# EAGLE design Hive Server - Electron (EAGLE 8.6.3)
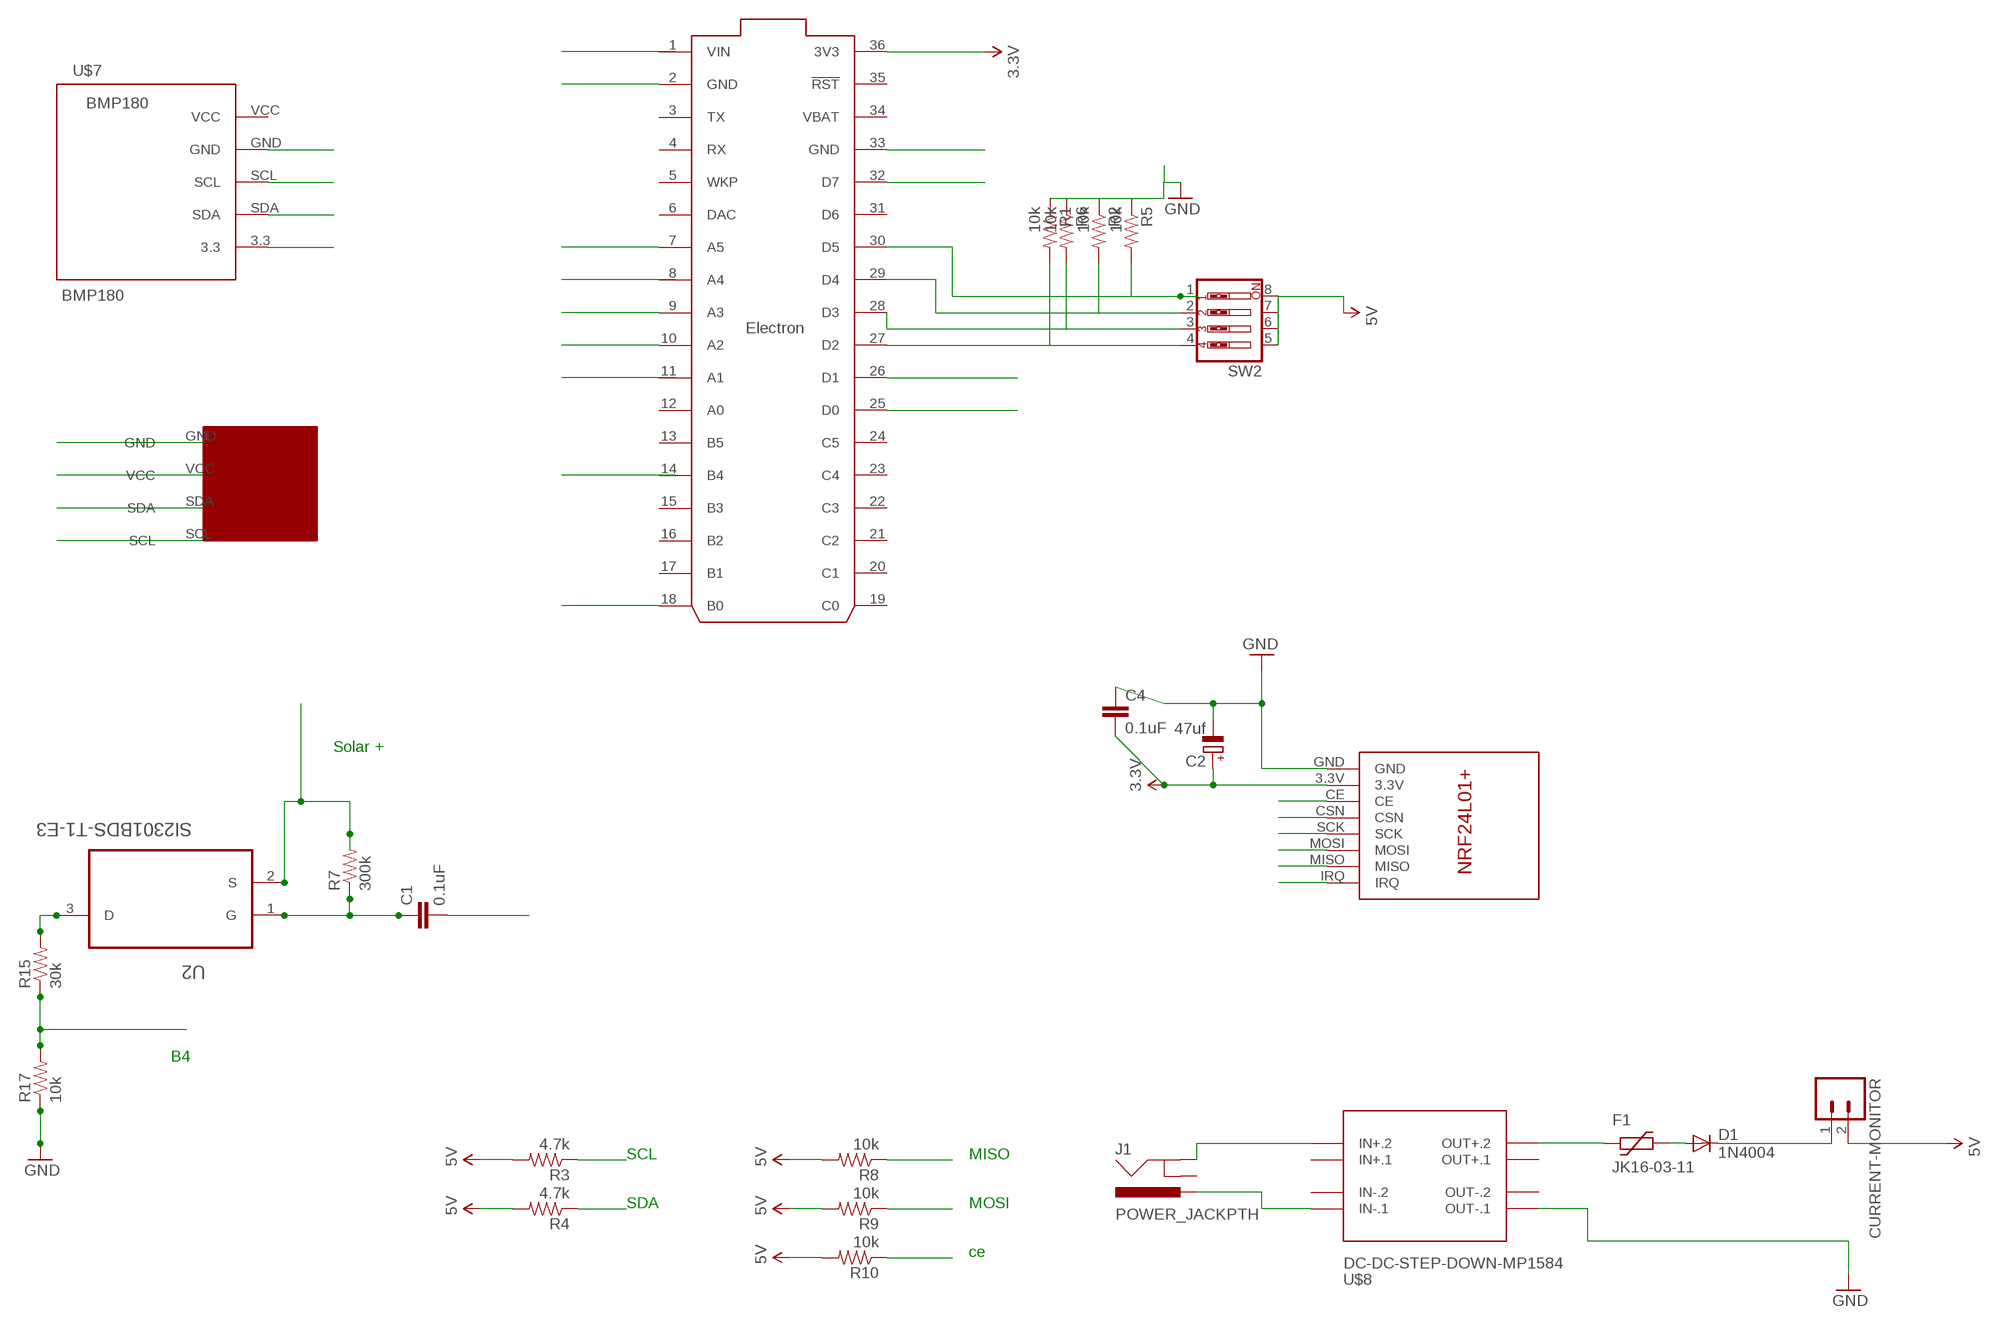
[diagram p0: schematic, sheet 1]

## Parts
C1  0.1uF  2.2UF-25V-+80/-20(0805)  [0805]
C2  47uf  CPOL-EUE2.5-5  [E2,5-5]
C4  0.1uF  2.2UF-25V-+80/-20(0805)  [0805]
CURRENT-MONITOR  M02PTH  [1X02]
D1  1N4004  [DO41-10]
F1  JK16-03-11  [JK16-03-11]
J1  POWER_JACKPTH  [POWER_JACK_PTH]
R1  10k  RESISTOR1206  [1206]
R2  10k  RESISTOR1206  [1206]
R3  4.7k  RESISTOR1206  [1206]
R4  4.7k  RESISTOR1206  [1206]
R5  10k  RESISTOR1206  [1206]
R6  10k  RESISTOR1206  [1206]
R7  300k  RESISTORPTH-1/6W  [1/6W-RES]
R8  10k  RESISTOR1206  [1206]
R9  10k  RESISTOR1206  [1206]
R10  10k  RESISTOR1206  [1206]
R15  30k  RESISTORPTH-1/6W  [1/6W-RES]
R17  10k  RESISTORPTH-1/6W  [1/6W-RES]
SW2  SW_DIP-4  [EDG-04]
U2  SI2301BDS-T1-E3  [SOT95P237X112-3N]
U$1  ELECTRON_WITH_HEADERS  [ELECTRON]
U$6  NRF24L01  [NRF24L01]
U$7  BMP180  BMP180BMP180  [1X05]
U$8  DC-DC-STEP-DOWN-MP1584  [DC-DC-STEP-DOWN-MP1584]
U$13  TJC8-4P  [TJC8-4P]

## Nets
3.3V: C2.+ C4.2 U$1.36(3V3) U$6.3.3V U$7.3.3
5V: CURRENT-MONITOR.2 R3.2 R4.2 R8.2 R9.2 R10.2 SW2.5 SW2.6 SW2.7 SW2.8 U$13.VCC
B4: R15.1 R17.2
CE_RADIO: R10.1 U$6.CE
CSN: U$1.10(A2) U$6.CSN
D7: C1.2 U$1.32(D7)
GND: C2.- C4.1 R1.1 R2.1 R5.1 R6.1 R17.1 U$1.2(GND) U$1.33(GND) U$6.GND U$7.GND U$8.OUT-.1 U$13.GND
IRQ: U$1.18(B0) U$6.IRQ
MISO: R8.1 U$6.MISO
MOSI: R9.1 U$1.7(A5) U$6.MOSI
N$1: CURRENT-MONITOR.1 D1.C
N$4: R5.2 SW2.1 U$1.30(D5)
N$5: R2.2 SW2.2 U$1.29(D4)
N$6: R6.2 SW2.3 U$1.28(D3)
N$7: R1.2 SW2.4 U$1.27(D2)
N$14: D1.A F1.P$2
N$16: F1.P$1 U$8.OUT+.2
N$19: J1.PWR U$8.IN-.1
N$25: C1.1 R7.1 U2.1(G)
N$28: R15.2 U2.3(D)
S+: J1.GND R7.2 U2.2(S) U$8.IN+.2
SCK: U$1.9(A3) U$6.SCK
SCL: R3.1 U$1.26(D1) U$7.SCL U$13.SCL
SDA: R4.1 U$1.25(D0) U$7.SDA U$13.SDA
Unconnected: J1.GNDBREAK U$1.3(TX) U$1.4(RX) U$1.5(WKP) U$1.6(DAC) U$1.8(A4) U$1.11(A1) U$1.12(A0) U$1.13(B5) U$1.14(B4) U$1.15(B3) U$1.16(B2) U$1.17(B1) U$1.19(C0) U$1.20(C1) U$1.21(C2) U$1.22(C3) U$1.23(C4) U$1.24(C5) U$1.31(D6) U$1.35(!RST) U$7.VCC U$8.IN+.1 U$8.IN-.2 U$8.OUT+.1 U$8.OUT-.2

## Notes on the sheet
- Solar +
- B4
- SCL | MISO
- SDA | MOSI
- ce

## Power pins joined to a net without a drawn wire
VBAT: U$1.34(VBAT)
VIN: U$1.1(VIN)

## Library data of the parts
C1 C4 = SparkFun-Capacitors:2.2UF-25V-+80/-20(0805): CAP-11624; PROD_ID: CAP-11624; VALUE: 2.2uF
C2 = rcl:CPOL-EU: POLARIZED CAPACITOR, European symbol
CURRENT-MONITOR = SparkFun-Connectors:M02: Standard 2-pin 0.1" header. Use with - straight break away headers ( PRT-00116) - right angle break away headers (PRT-00553) - swiss pins (PRT-00743) - machine pins (PRT-00117) - female headers (PRT-00115) Molex polarized connector foot print use with: PRT-08233 with associated crimp pins and housings. 2.54_SCREWTERM for use with PRT-10571. 3.5mm Screw Terminal footprints for PRT-08084 5mm Screw Terminal footprints for use with PRT-08432
D1 = adafruit:1N4004: DIODE General purpose 1N400x type rectifier (With bigger pads) http://www.ladyada.net/library/pcb/eaglelibrary.html
F1 = ptc-littlefuse:JK16-03-11
J1 = SparkFun-Connectors:POWER_JACK: Power Jack This is the standard 5.5mm barrel jack for power. The PTH is the most common, proven, reliable, footprint. The Slot footprint only works if the mill layer is transmitted to the PCB fab house so be warned. Mating wall wart : TOL-00298 (and others); PROD_ID: PRT-00119
R1-R6 R8-R10 = SparkFun-Passives:RESISTOR: Resistor Basic schematic elements and footprints for 0603, 1206, and PTH resistors.
R7 R15 R17 = SparkFun-Resistors:RESISTOR: Resistor Basic schematic elements and footprints for 0603, 1206, and PTH resistors.
SW2 = special:SW_DIP-4: DIP SWITCH
U2 = Vishay_By_element14_Batch_1:SI2301BDS-T1-E3: MOSFET; MPN: SI2301BDS-T1-E3; OC_FARNELL: 1470099; OC_NEWARK: 06J7561; PACKAGE: SOT-23-3; SUPPLIER: VISHAY
U$1 = Particle-Devices:ELECTRON
U$6 = eBay parts:NRF24L01: NRF24L01+ module from eBay NOTE: Untested layout
U$7 = chris_Library:BMP180
U$8 = diy-modules:DC-DC-STEP-DOWN-MP1584: DC/DC Step-Down Regulator based on MP1584 chip MP1584 datasheet available here: http://www.haoyuelectronics.com/Attachment/MP1584/MP1584.pdf Click here to find device on ebay.com <http://www.ebay.com/sch/mp1584+module>
U$13 = chris_Library:TJC8-4P

## Board
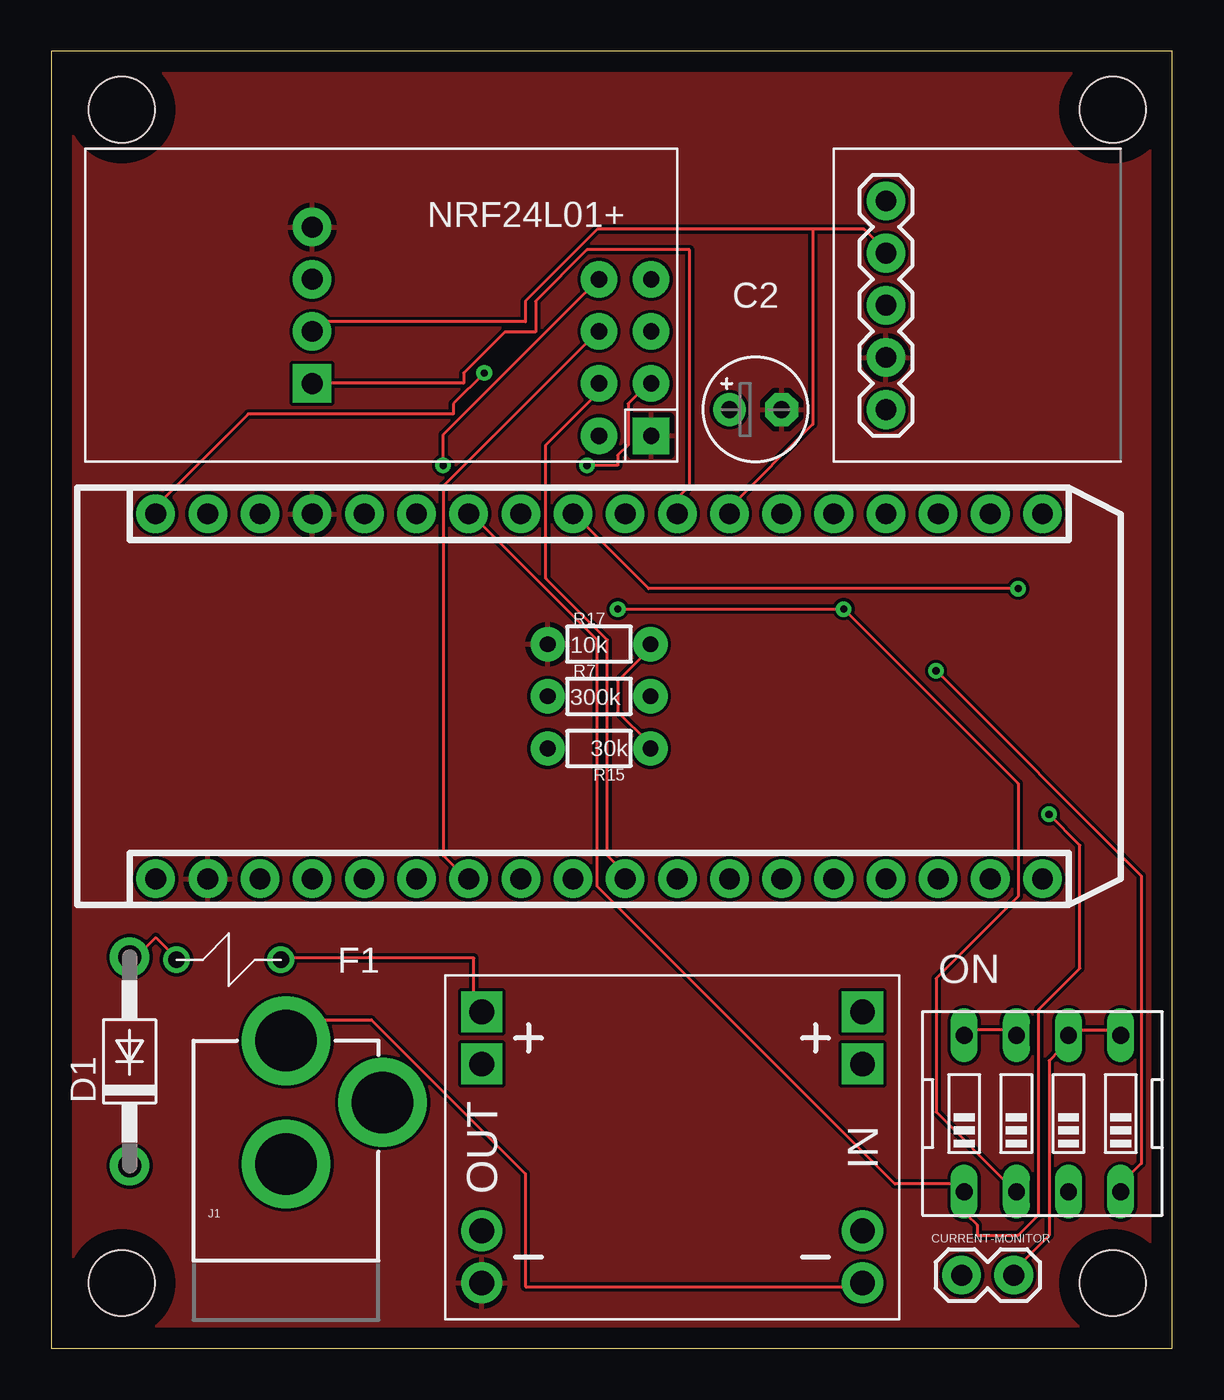
[diagram p1: board, top side]
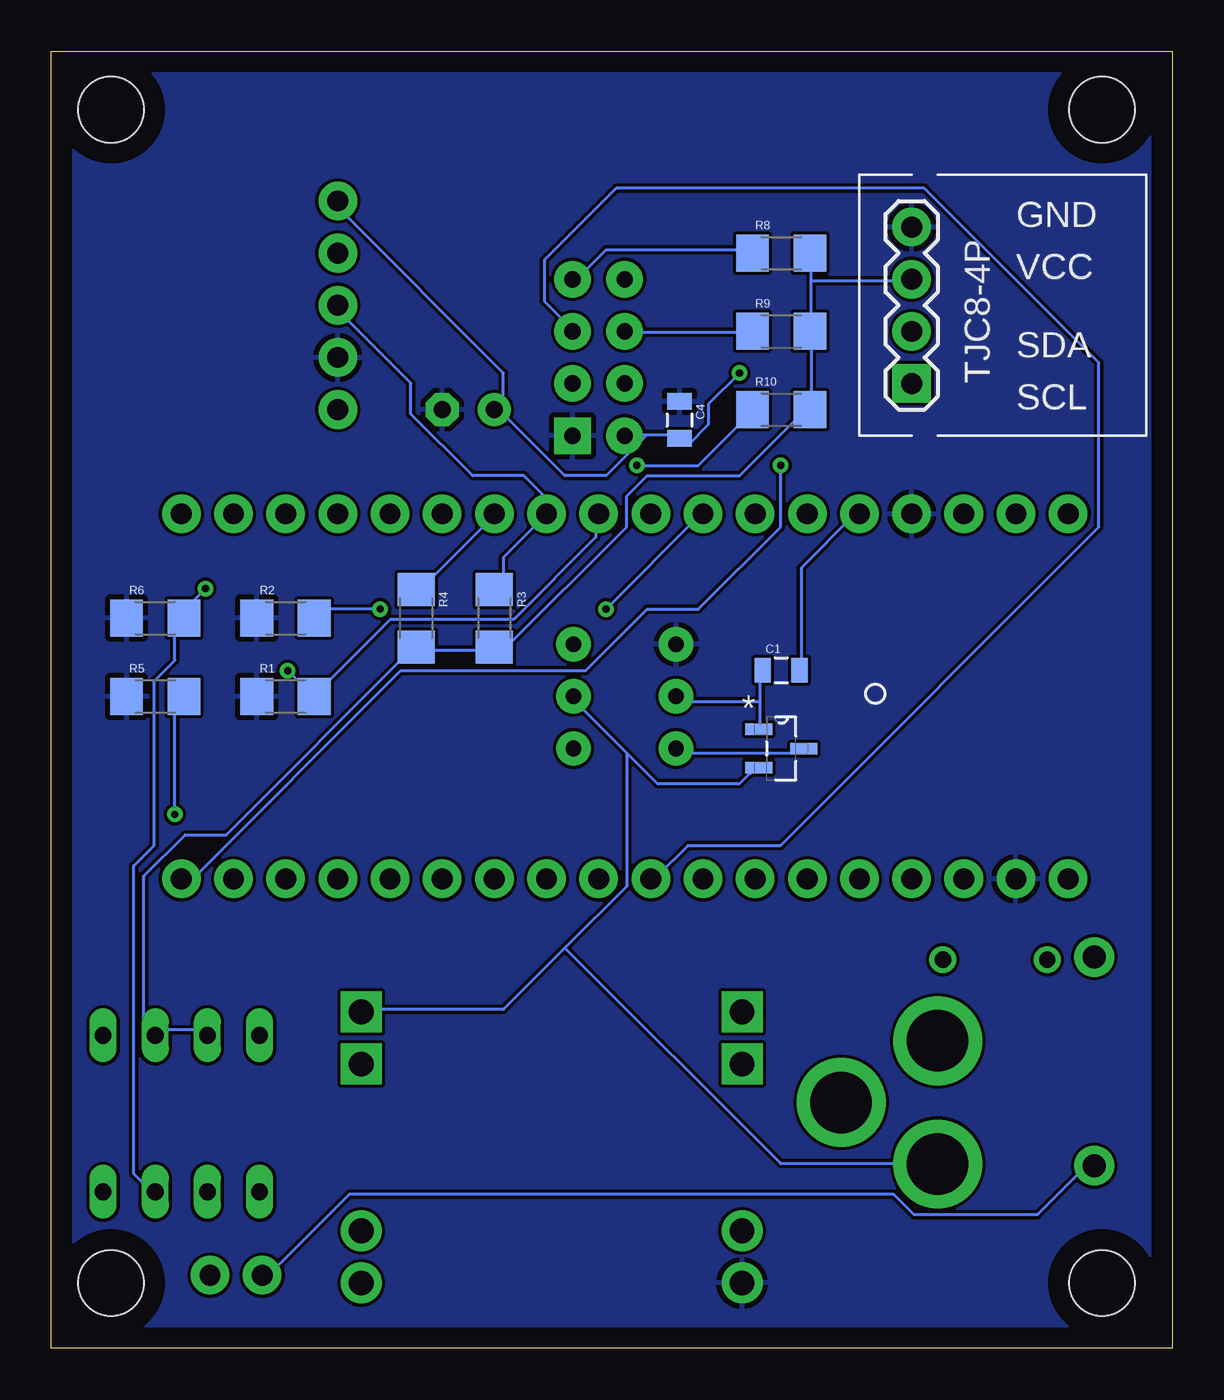
[diagram p2: board, bottom side, seen from below]

Size 54.59 x 63.17 mm. Coordinates in mm from the lower left corner, seen from the top.
Outline: 0,0 54.59,0 54.59,63.17 0,63.17 0,0
Copper layers (1*16): Top 0.035mm / dielectric 1.5mm / Bottom 0.035mm
Design rules "default": minimum track width 6mil, minimum drill 0.35mm, track to track 6mil, track to pad 6mil, pad to pad 6mil, via to via 6mil, smd to smd 6mil, copper to edge 40mil, drill to drill 6mil, minimum pad ring 10mil, minimum via ring 8mil, stop-mask expansion 4mil, vias tented up to drill 0mil, thermal gap 10mil
Holes 3.2 mm at 3.43,60.33 51.69,60.33 51.69,3.17 3.43,3.17

### Footprints (pad centres in the part's own frame; a part is rotated, then mirrored left to right if it is on the bottom)
0805 = smd 0.8 x 1.2: 1 -0.9,0; 2 0.9,0
E2,5-5 = drill 0.813 pad 1.6: + -1.27,0 | drill 0.813 pad 1.6 octagon: - 1.27,0
1X02 = drill 1.016 pad 1.88: 1 0,0; 2 2.54,0
DO41-10 = drill 1.118 pad 1.93: A 5.08,0; C -5.08,0
JK16-03-11 = drill 0.8: P$1 -2.54,0; P$2 2.54,0
POWER_JACK_PTH = drill 2.997 pad 4.318: GND 0,7.7; GNDBREAK 4.7,10.7; PWR 0,13.7
1206 = smd 1.6 x 1.8: 1 -1.4,0; 2 1.4,0
1/6W-RES = drill 0.762 pad 1.676: 1 -2.5,0; 2 2.5,0
EDG-04 = drill 0.813 long: 1 -3.81,-3.81; 2 -1.27,-3.81; 3 1.27,-3.81; 4 3.81,-3.81; 5 3.81,3.81; 6 1.27,3.81; 7 -1.27,3.81; 8 -3.81,3.81
SOT95P237X112-3N = smd 1.321 x 0.559: 1 -1.092,0.94; 2 -1.092,-0.94; 3 1.092,0
ELECTRON = drill 1.016 pad 1.88: 1 1.27,46.99; 2 1.27,44.45; 3 1.27,41.91; 4 1.27,39.37; 5 1.27,36.83; 6 1.27,34.29; 7 1.27,31.75; 8 1.27,29.21; 9 1.27,26.67; 10 1.27,24.13; 11 1.27,21.59; 12 1.27,19.05; 13 1.27,16.51; 14 1.27,13.97; 15 1.27,11.43; 16 1.27,8.89; 17 1.27,6.35; 18 1.27,3.81; 19 19.05,3.81; 20 19.05,6.35; 21 19.05,8.89; 22 19.05,11.43; 23 19.05,13.97; 24 19.05,16.51; 25 19.05,19.05; 26 19.05,21.59; 27 19.05,24.13; 28 19.05,26.67; 29 19.05,29.21; 30 19.05,31.75; 31 19.05,34.29; 32 19.05,36.83; 33 19.05,39.37; 34 19.05,41.91; 35 19.05,44.45; 36 19.05,46.99
NRF24L01 = drill 0.8 pad 1.778: 3.3V 0,2.54; CE 2.54,0; CSN 2.54,2.54; IRQ 7.62,2.54; MISO 7.62,0; MOSI 5.08,2.54; SCK 5.08,0 | drill 0.8 pad 1.778 square: GND 0,0
1X05 = drill 1.016 pad 1.88: 3.3 10.16,0; GND 2.54,0; SCL 5.08,0; SDA 7.62,0; VCC 0,0
DC-DC-STEP-DOWN-MP1584 = drill 1.2 pad 2 square: IN+.1 -9.271,-4.064; IN+.2 -9.271,-6.604; OUT+.1 9.271,-4.064; OUT+.2 9.271,-6.604 | drill 1.2 pad 2: IN-.1 -9.271,6.604; IN-.2 -9.271,4.064; OUT-.1 9.271,6.604; OUT-.2 9.271,4.064
TJC8-4P = drill 1.016 pad 1.88: GND 7.62,0; SDA 2.54,0; VCC 5.08,0 | drill 1.016 pad 1.88 square: SCL 0,0

### Placement (x,y rotation side)
C1  19.05,33.02 0 bottom
C2  34.29,45.72 0 top
C4  24,45.21 270 bottom
CURRENT-MONITOR  44.32,3.56 0 top
D1  3.81,13.97 90 top
F1  8.64,18.92 180 top
J1  11.43,1.27 0 top
R1  43.18,31.75 0 bottom
R2  43.18,35.56 0 bottom
R3  33.02,35.56 270 bottom
R4  36.83,35.56 270 bottom
R5  49.53,31.75 0 bottom
R6  49.53,35.56 0 bottom
R7  26.67,31.75 0 top
R8  19.05,53.34 0 bottom
R9  19.05,49.53 0 bottom
R10  19.05,45.72 0 bottom
R15  26.67,29.21 180 top
R17  26.67,34.29 0 top
SW2  48.26,11.43 0 top
U2  19.05,29.21 0 bottom
U$1  52.07,21.59 90 top
U$6  29.21,44.45 90 top
U$7  40.64,45.72 90 top
U$8  30.23,9.78 180 top
U$13  12.7,46.99 90 bottom

### Tracks (layer width: path | path; a pad name or v marks a point on that pad's centre or on a via)
3.3V  (via drill 0.35)
  Top 0.152: v21.08,47.5 19.58,46 19.58,45.5 9.58,45.5 5.08,41 U$1.36
  Bottom 0.152: 25.58,44.5 26.58,44.5 U$6.3.3V | 25.58,44.5 24.08,44.5 C4.2 23.58,44 22.58,45 22.58,46 v21.08,47.5 | 25.58,44.5 27.58,42.5 29.58,42.5 32.58,45.5 C2.+ 32.58,46 32.58,47.5 40.58,55.5 U$7.3.3
5V
  Top 0.152: SW2.8 44.58,15.5 46.58,15.5 SW2.7 | SW2.5 51.58,15.5 49.58,15.5 SW2.6 49.08,15 49.08,14.5 48.58,14 48.58,5.5 47.08,4 CURRENT-MONITOR.2
  Bottom 0.152: 17.58,52 17.58,50 R9.2 17.58,49.5 17.58,46 R10.2 18.08,45.5 21.08,42.5 25.58,42.5 26.58,41.5 26.58,40 32.58,34 R3.2 33.08,34 36.58,34 R4.2 37.08,34 46.08,25 48.08,25 50.08,23 50.08,16 49.58,15.5 SW2.6 49.08,15.5 47.08,15.5 SW2.7 | 17.58,52 17.58,53 R8.2 | 17.58,52 13.08,52 U$13.VCC
B4
  Top 0.152: R15.1 29.08,29.5 27.58,31 27.58,32.5 29.08,34 R17.2
CE_RADIO  (via drill 0.35)
  Top 0.152: v26.08,43 27.58,43 27.58,43.5 28.08,44 28.08,46 29.08,47 U$6.CE
  Bottom 0.152: v26.08,43 23.08,43 20.58,45.5 R10.1
CSN
  Top 0.152: U$6.CSN 26.58,46.5 24.08,44 24.08,37.5 27.08,34.5 27.08,24 27.58,23.5 27.58,23 U$1.10
D7
  Bottom 0.152: C1.2 18.08,33.5 18.08,38 15.58,40.5 U$1.32
GND
  pour Bottom: -20.32,133.35 180.34,135.89 180.34,-6.35 -2.54,-6.35 -20.32,-7.62
  pour Top: -30.48,129.54 181.61,133.35 181.61,-8.89 -1.27,-8.89 -30.48,-11.43
IRQ  (via drill 0.35)
  Top 0.152: v19.08,43 19.08,44.5 26.58,52 U$6.IRQ
  Bottom 0.152: v19.08,43 19.08,40 23.08,36 25.58,36 28.58,33 37.58,33 48.08,22.5 U$1.18
MISO
  Bottom 0.152: R8.1 20.58,53.5 27.58,53.5 29.08,52 U$6.MISO
MOSI
  Top 0.152: U$1.7 20.08,23 19.08,24 19.08,42 26.58,49.5 U$6.MOSI
  Bottom 0.152: R9.1 20.58,49.5 26.58,49.5 U$6.MOSI
N$1
  Bottom 0.152: CURRENT-MONITOR.1 44.08,4 43.58,4 40.08,7.5 13.58,7.5 12.58,6.5 6.58,6.5 4.08,9 D1.C
N$4  (via drill 0.35)
  Top 0.152: v48.58,26 50.08,24.5 50.08,18.5 48.08,16.5 48.08,6.5 47.08,5.5 45.08,5.5 45.08,6 44.58,6.5 44.58,7.5 SW2.1 44.08,8 41.08,8 26.58,22.5 26.58,34.5 20.58,40.5 U$1.30
  Bottom 0.152: v48.58,26 48.58,31.5 R5.2
N$5  (via drill 0.35)
  Top 0.152: v27.58,36 v38.58,36 47.08,27.5 47.08,22 43.08,18 43.08,11.5 46.58,8 SW2.2
  Bottom 0.152: v38.58,36 41.58,36 R2.2 | v27.58,36 23.08,40.5 U$1.29
N$6  (via drill 0.35)
  Top 0.152: v47.08,37 29.08,37 25.58,40.5 U$1.28
  Bottom 0.152: SW2.3 49.58,7.5 50.58,8.5 50.58,23.5 49.58,24.5 49.58,32.5 48.58,33.5 48.58,35.5 R6.2 48.08,36 v47.08,37
N$7  (via drill 0.35)
  Top 0.152: v43.08,33 53.08,23 53.08,9 52.08,8 SW2.4
  Bottom 0.152: U$1.27 28.08,40.5 28.08,39.5 32.08,35.5 38.08,35.5 41.58,32 R1.2 42.08,32 v43.08,33
N$14
  Top 0.152: F1.P$2 6.08,19 5.08,20 4.08,19 D1.A
N$16
  Top 0.152: F1.P$1 11.58,19 20.58,19 20.58,16.5 U$8.OUT+.2
N$19
  Top 0.152: U$8.IN-.1 39.08,3 23.08,3 23.08,8.5 15.58,16 11.58,16 11.58,15 J1.PWR
N$25
  Bottom 0.152: 20.08,31.5 20.08,30 U2.1 | 20.08,31.5 20.08,33 C1.1 | 20.08,31.5 24.08,31.5 R7.1
N$28
  Bottom 0.152: U2.3 18.08,29 24.08,29 R15.2
S+
  Bottom 0.152: 26.58,29 29.08,31.5 R7.2 | 26.58,29 25.08,27.5 21.08,27.5 20.58,28 U2.2 | 29.58,19.5 26.58,22.5 26.58,29 | 29.58,19.5 32.58,16.5 39.08,16.5 U$8.IN+.2 | 29.58,19.5 19.08,9 11.58,9 J1.GND
SCK
  Bottom 0.152: U$6.SCK 29.58,50 30.58,51 30.58,53 27.08,56.5 12.08,56.5 3.58,48 3.58,40 19.08,24.5 23.58,24.5 25.08,23 U$1.9
SCL
  Top 0.152: U$13.SCL 13.08,47 20.08,47 20.08,47.5 22.08,49.5 23.58,49.5 23.58,51 26.08,53.5 31.08,53.5 31.08,42 30.58,41.5 30.58,41 U$1.26
  Bottom 0.152: R3.1 32.58,37 32.58,38.5 30.58,40.5 U$1.26 30.08,41 31.58,42.5 34.08,42.5 37.08,45.5 37.08,47 40.58,50.5 U$7.SCL
SDA
  Top 0.152: 37.08,54.5 39.58,54.5 40.58,53.5 U$7.SDA | 37.08,54.5 26.58,54.5 23.08,51 23.08,50 13.08,50 U$13.SDA | 37.08,54.5 37.08,45 33.08,41 U$1.25
  Bottom 0.152: R4.1 36.58,37 33.08,40.5 U$1.25

### Text on the board
tNames: ON